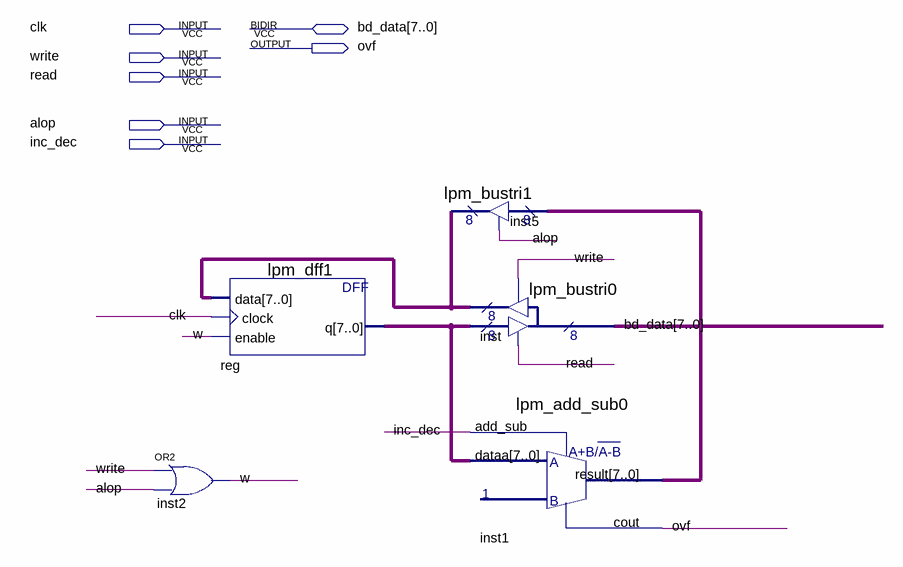
[diagram p0: schematic sheet]
// Quartus schematic WN_register.bdf as structural Verilog: 5 symbols, 7 pins
module WN_register (
  input  clk,
  input  write,
  input  read,
  input  alop,
  input  inc_dec,
  inout  [7:0] bd_data,
  output ovf
);

  wire w;
  wire [7:0] inst1_result, inst5_tridata, reg_q;

  or inst2 (w, write, alop);
  lpm_dff1 \reg  (.data(inst5_tridata), .clock(clk), .enable(w), .q(reg_q));
  lpm_bustri1 inst5 (.enabledt(alop), .data(inst1_result), .tridata(inst5_tridata));
  lpm_bustri0 inst (.enabledt(read), .data(reg_q), .enabletr(write), .result(inst5_tridata), .tridata(bd_data));
  lpm_add_sub0 inst1 (.dataa(reg_q), .add_sub(inc_dec), .result(inst1_result), .cout(ovf));
endmodule
